# Altium schematic sheet Sheet1.SchDoc
size A4; SheetNumber: 1; SheetTotal: 1
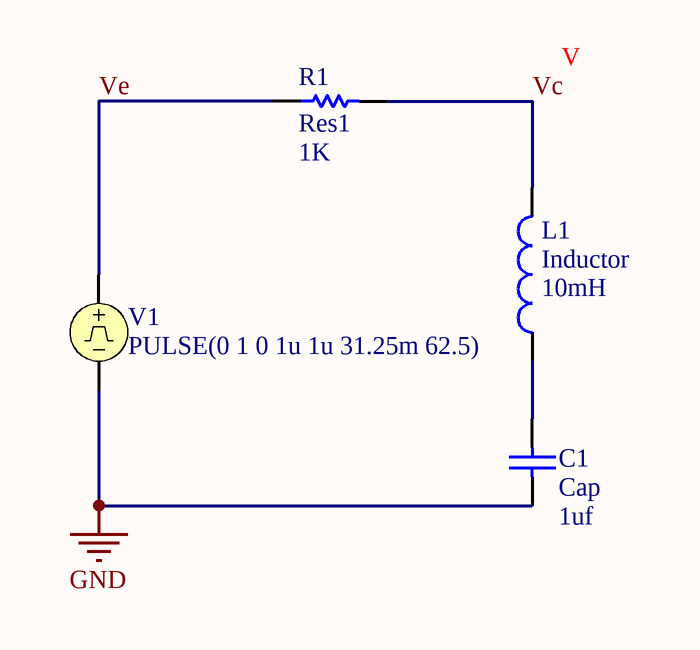
[diagram p0: Sheet1.SchDoc]

## Parts
C1  Cap  value 1uf  [RAD-0.3]
L1  Inductor  value 10mH  [0402-A]
R1  Res1  value 1K  [AXIAL-0.3]
V1  PULSE(0 1 0 1u 1u 31.25m 62.5)

## Nets
GND: C1.2 V1.2
Vc: L1.2 R1.2
Ve: R1.1 V1.1
NetC1_1: C1.1 L1.1

## Library data of the parts
C1 = Cap: Capacitor; Published: 8-Jun-2000; LatestRevisionDate: 17-Jul-2002; LatestRevisionNote: Re-released for DXP Platform.; PackageReference: RAD-0.3; Publisher: Altium Limited; PackageDescription: Radial Cap, Thru-Hole; 2 Leads; 0.3 in Pin Spacing
L1 = Inductor: Code_IEC: 1005; Published: 8-Jun-2000; LatestRevisionDate: 29-May-2009; LatestRevisionNote: IPC-7351 Footprint Added.; PackageReference: 0402-A; Publisher: Altium Limited; PackageDescription: Chip Inductor; Code_JEITA: 0402
R1 = Res1: Resistor; Published: 8-Jun-2000; LatestRevisionDate: 17-Jul-2002; LatestRevisionNote: Re-released for DXP Platform.; PackageReference: AXIAL-0.3; Publisher: Altium Limited; PackageDescription: Axial Device, Thru-Hole; 2 Leads; 0.3 in Pin Spacing
V1 = VPULSE: Pulse Voltage Source; Note: PCB Footprint - Not required; Initial Value: 0; Pulsed Value: 1; Period: 62.5; Published: 8-Jun-2000; LatestRevisionDate: 15-Nov-2004; LatestRevisionNote: Corrected Netlist.; PackageReference: Not Applicable; Publisher: Altium Limited; Rise Time: 1u; Fall Time: 1u; Pulse Width: 31.25m; DC Magnitude: 0; AC Magnitude: 1; AC Phase: 0